# Altium schematic sheet MAGI'sBatteryPowerMega.SchDoc
size A4
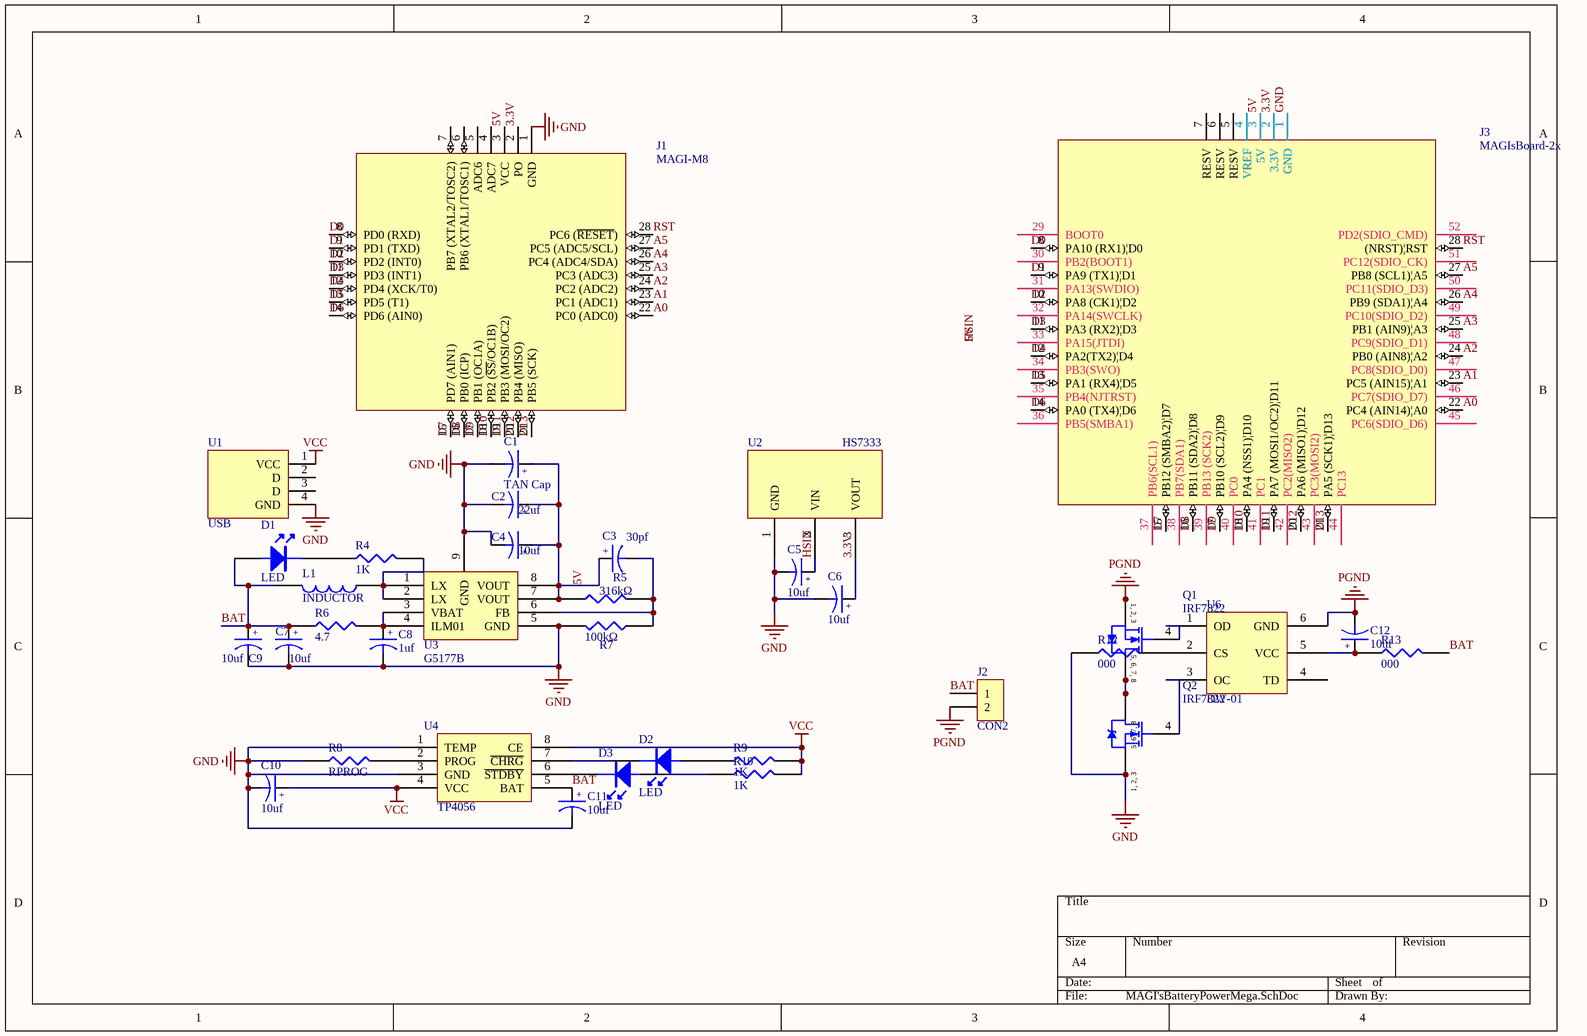
[diagram p0: MAGI'sBatteryPowerMega.SchDoc]

## Parts
C1  TAN Cap  [TAN-D-7343]
C2  22uf  [14-1210]
C3  30pf  [6-0805_N]
C4  10uf  [6-0805_N]
C5  10uf  [6-0805_N]
C6  10uf  [6-0805_N]
C7  10uf  [6-0805_N]
C8  1uf  [6-0805_N]
C9  10uf  [6-0805_N]
C10  10uf  [6-0805_N]
C11  10uf  [6-0805_N]
C12  10uf  [6-0805_N]
D1  LED  [6-0805_N]
D2  LED  [6-0805_N]
D3  LED  [6-0805_N]
J1  MAGI-M8  [MAGI-M8]
J2  CON2  [18650]
J3  MAGIsBoard-2x  [MAGIsBoard-2x]
L1  INDUCTOR  [7*7]
Q1  IRF7822  [SO-8_N]
Q2  IRF7822  [SO-8_N]
R4  1K  [6-0805_N]
R5  316kΩ  [6-0805_N]
R6  4.7  [6-0805_N]
R7  100kΩ  [6-0805_N]
R8  RPROG  [6-0805_N]
R9  1K  [6-0805_N]
R10  1K  [6-0805_N]
R12  000  [6-0805_n]
R13  000  [6-0805_n]
U1  USB  [MicroUSB]
U2  HS7333  [HS7333]
U3  G5177B  [G5177B]
U4  TP4056  [TP4056]
U6  DW-01  [TPS2513]

## Nets
GND: C1.2 C2.2 C4.2 C5.2 C6.2 C7.2 C8.2 C9.2 C10.2 C11.2 J1.1(GND) J3.1(GND) Q2.1(S) Q2.2(S) Q2.3(S) R7.2 R8.1 R12.1 U1.4(GND) U2.1(GND) U3.5(GND) U3.9(GND) U4.1(TEMP) U4.3(GND)
PGND: C12.2 J2.2 Q1.1(S) Q1.2(S) Q1.3(S) U6.6(GND)
VCC: C10.1 R9.2 R10.2 U1.1(VCC) U4.4(VCC) U4.8(CE)
3.3V: C6.1 J1.2(PO) J3.2(3.3V) U2.3(VOUT)
5V: C1.1 C2.1 C3.1 C4.1 C5.1 J1.3(VCC) J3.3(5V) R5.1 U2.2(VIN) U3.7(VOUT) U3.8(VOUT)  [also labelled HSIN]
A0: J1.22(PC0_(ADC0)) J3.22(PC4_(AIN14)|A0)
A1: J1.23(PC1_(ADC1)) J3.23(PC5_(AIN15)|A1)
A2: J1.24(PC2_(ADC2)) J3.24(PB0_(AIN8)|A2)
A3: J1.25(PC3_(ADC3)) J3.25(PB1_(AIN9)|A3)
A4: J1.26(PC4_(ADC4/SDA)) J3.26(PB9_(SDA1)|A4)
A5: J1.27(PC5_(ADC5/SCL)) J3.27(PB8_(SCL1)|A5)
BAT: C7.1 C9.1 C11.1 D1.1 J2.1 L1.2 R6.1 R13.2 U4.5(BAT)
D0: J1.8(PD0_(RXD)) J3.8(PA10_(RX1)|D0)
D1: J1.9(PD1_(TXD)) J3.9(PA9_(TX1)|D1)
D2: J1.10(PD2_(INT0)) J3.10(PA8_(CK1)|D2)
D3: J1.11(PD3_(INT1)) J3.11(PA3_(RX2)|D3)
D4: J1.12(PD4_(XCK/T0)) J3.12(PA2(TX2)|D4)
D5: J1.13(PD5_(T1)) J3.13(PA1_(RX4)|D5)
D6: J1.14(PD6_(AIN0)) J3.14(PA0_(TX4)|D6)
D7: J1.15(PD7_(AIN1)) J3.15(PB12_(SMBA2)|D7)
D8: J1.16(PB0_(ICP)) J3.16(PB11_(SDA2)|D8)
D9: J1.17(PB1_(OC1A)) J3.17(PB10_(SCL2)|D9)
D10: J1.18(PB2_(~{SS}/OC1B)) J3.18(PA4_(NSS1)|D10)
D11: J1.19(PB3_(MOSI/OC2)) J3.19(PA7_(MOSI1/OC2)|D11)
D12: J1.20(PB4_(MISO)) J3.20(PA6_(MISO1)|D12)
D13: J1.21(PB5_(SCK)) J3.21(PA5_(SCK1)|D13)
RST: J1.28(PC6_(~{RESET})) J3.28((NRST)|RST)
NetC3_2: C3.2 R5.2 R7.1 U3.6(FB)
NetC8_1: C8.1 R6.2 U3.3(VBAT) U3.4(ILM01)
NetC12_1: C12.1 R13.1 U6.5(VCC)
NetD1_2: D1.2 R4.1
NetD2_1: D2.1 R9.1
NetD2_2: D2.2 U4.7(~{CHRG})
NetD3_1: D3.1 R10.1
NetD3_2: D3.2 U4.6(~{STDBY})
NetL1_1: L1.1 R4.2 U3.1(LX) U3.2(LX)
NetQ1_4: Q1.4(G) U6.1(OD)
NetQ1_5: Q1.5(D) Q1.6(D) Q1.7(D) Q1.8(D) Q2.5(D) Q2.6(D) Q2.7(D) Q2.8(D)
NetQ2_4: Q2.4(G) U6.3(OC)
NetR8_2: R8.2 U4.2(PROG)
NetR12_2: R12.2 U6.2(CS)

Not connected (* = marked no-connect by the designer): J1 4(ADC7) 5(ADC6) 6(PB6_(XTAL1/TOSC1)) 7(PB7_(XTAL2/TOSC2)); J3 4(VREF) 5(RESV) 6(RESV) 7(RESV) 29(BOOT0) 30(PB2(BOOT1)) 31(PA13(SWDIO)) 32(PA14(SWCLK)) 33(PA15(JTDI)) 34(PB3(SWO)) 35(PB4(NJTRST)) 36(PB5(SMBA1)) 37(PB6(SCL1)) 38(PB7(SDA1)) 39(PB13_(SCK2)) 40(PC0) 41(PC1) 42(PC2(MISO2)) 43(PC3(MOSI2)) 44(PC13) 45(PC6(SDIO_D6)) 46(PC7(SDIO_D7)) 47(PC8(SDIO_D0)) 48(PC9(SDIO_D1)) 49(PC10(SDIO_D2)) 50(PC11(SDIO_D3)) 51(PC12(SDIO_CK)) 52(PD2(SDIO_CMD)); U1 2(D) 3(D); U6 4(TD)

## Notes on the sheet
- (in symbol CAPACITOR POL) +
- (in symbol IRF7822) 1, 2, 3; 5, 6, 7, 8

## Library data of the parts
C1-C12 = CAPACITOR POL: Capacitor
J2 = CON2: Connector
Q1 Q2 = IRF7822: HEXFET Power MOSFET; Published: 17-Sep-2003; LatestRevisionDate: 13-Apr-2006; LatestRevisionNote: IPC-7351 Footprint Added.; DatasheetVersion: 11-Jul-2001; PackageVersion: Feb-2001; PackageReference: SO-8; Publisher: Altium Limited; PackageDescription: 8-Pin Plastic Small Outline Integrated Circuit 1.27 mm Pitch; Code_JEDEC: MS-012-AA; Code_IPC: SOIC127P600-8; ComponentLink1Description: Manufacturer Link; ComponentLink1URL: http://www.irf.com/; ComponentLink2Description: Datasheet; ComponentLink2URL: http://www.irf.com/product-info/datasheets/data/irf7822.pdf
R4-R10 R12 R13 = RES1
U6 = TPS2513